# Altium schematic sheet In-Out.SchDoc
size A2
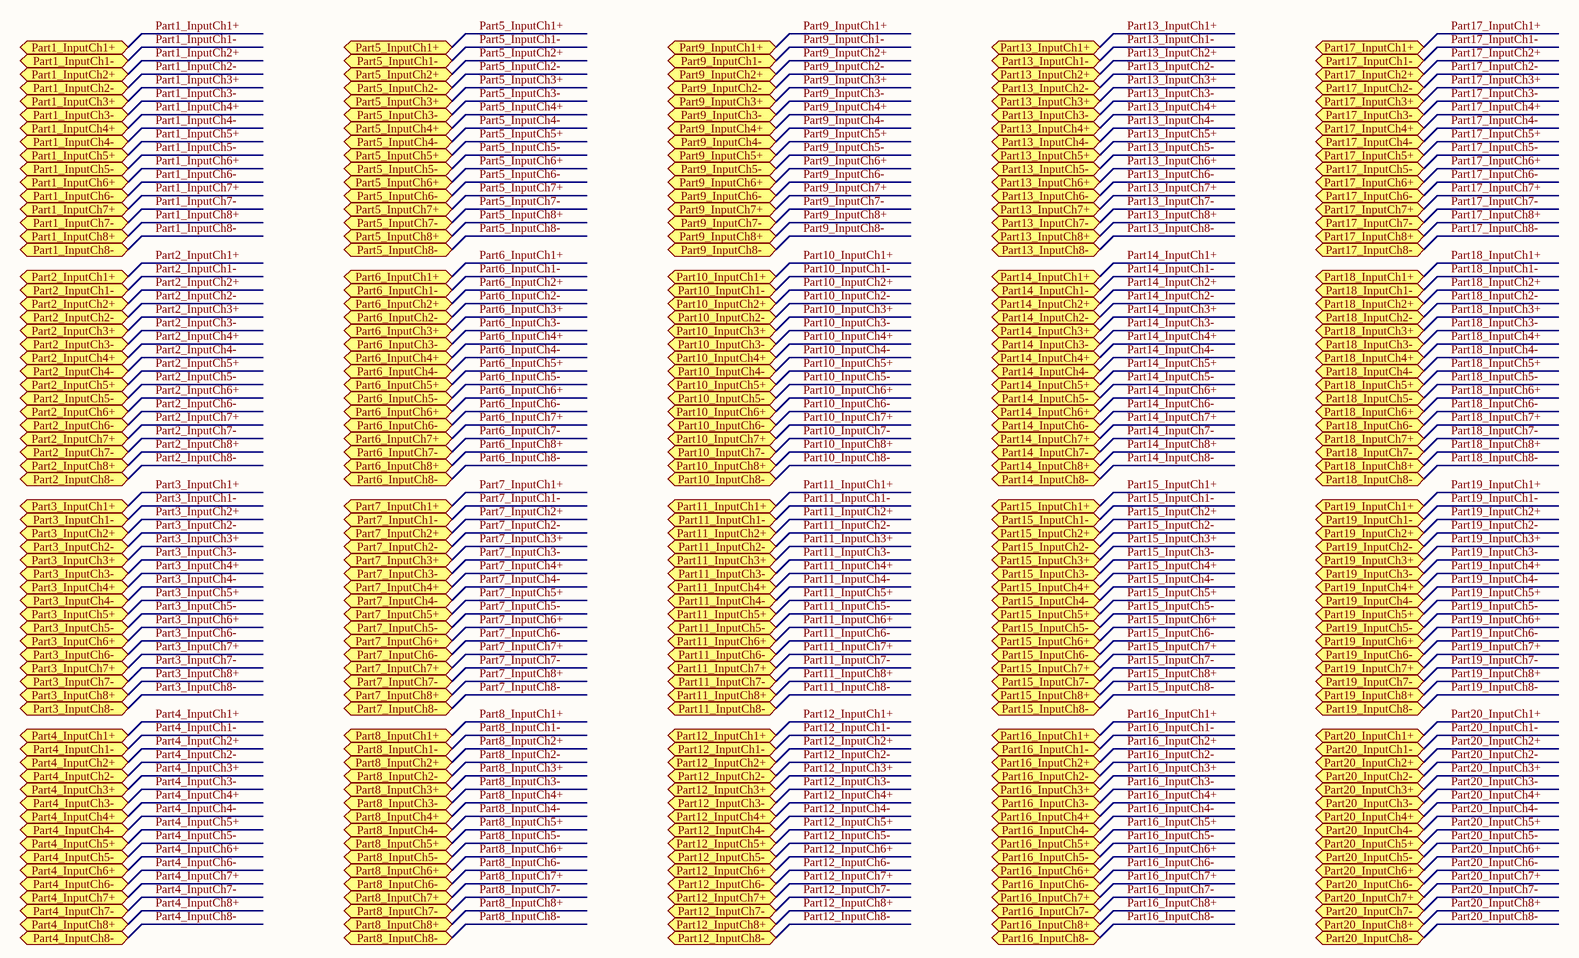
[diagram p0: In-Out.SchDoc]

## Ports
Part1_InputCh1+ (out), Part1_InputCh1- (out), Part1_InputCh2+ (out), Part1_InputCh2- (out), Part1_InputCh3+ (out), Part1_InputCh3- (out), Part1_InputCh4+ (out), Part1_InputCh4- (out), Part1_InputCh5+ (out), Part1_InputCh5- (out), Part1_InputCh6+ (out), Part1_InputCh6- (out), Part1_InputCh7+ (out), Part1_InputCh7- (out), Part1_InputCh8+ (out), Part1_InputCh8- (out), Part2_InputCh1+ (out), Part2_InputCh1- (out), Part2_InputCh2+ (out), Part2_InputCh2- (out), Part2_InputCh3+ (out), Part2_InputCh3- (out), Part2_InputCh4+ (out), Part2_InputCh4- (out), Part2_InputCh5+ (out), Part2_InputCh5- (out), Part2_InputCh6+ (out), Part2_InputCh6- (out), Part2_InputCh7+ (out), Part2_InputCh7- (out), Part2_InputCh8+ (out), Part2_InputCh8- (out), Part3_InputCh1+ (out), Part3_InputCh1- (out), Part3_InputCh2+ (out), Part3_InputCh2- (out), Part3_InputCh3+ (out), Part3_InputCh3- (out), Part3_InputCh4+ (out), Part3_InputCh4- (out), Part3_InputCh5+ (out), Part3_InputCh5- (out), Part3_InputCh6+ (out), Part3_InputCh6- (out), Part3_InputCh7+ (out), Part3_InputCh7- (out), Part3_InputCh8+ (out), Part3_InputCh8- (out), Part4_InputCh1+ (out), Part4_InputCh1- (out), Part4_InputCh2+ (out), Part4_InputCh2- (out), Part4_InputCh3+ (out), Part4_InputCh3- (out), Part4_InputCh4+ (out), Part4_InputCh4- (out), Part4_InputCh5+ (out), Part4_InputCh5- (out), Part4_InputCh6+ (out), Part4_InputCh6- (out), Part4_InputCh7+ (out), Part4_InputCh7- (out), Part4_InputCh8+ (out), Part4_InputCh8- (out), Part5_InputCh1+ (out), Part5_InputCh1- (out), Part5_InputCh2+ (out), Part5_InputCh2- (out), Part5_InputCh3+ (out), Part5_InputCh3- (out), Part5_InputCh4+ (out), Part5_InputCh4- (out), Part5_InputCh5+ (out), Part5_InputCh5- (out), Part5_InputCh6+ (out), Part5_InputCh6- (out), Part5_InputCh7+ (out), Part5_InputCh7- (out), Part5_InputCh8+ (out), Part5_InputCh8- (out), Part6_InputCh1+ (out), Part6_InputCh1- (out), Part6_InputCh2+ (out), Part6_InputCh2- (out), Part6_InputCh3+ (out), Part6_InputCh3- (out), Part6_InputCh4+ (out), Part6_InputCh4- (out), Part6_InputCh5+ (out), Part6_InputCh5- (out), Part6_InputCh6+ (out), Part6_InputCh6- (out), Part6_InputCh7+ (out), Part6_InputCh7- (out), Part6_InputCh8+ (out), Part6_InputCh8- (out), Part7_InputCh1+ (out), Part7_InputCh1- (out), Part7_InputCh2+ (out), Part7_InputCh2- (out), Part7_InputCh3+ (out), Part7_InputCh3- (out), Part7_InputCh4+ (out), Part7_InputCh4- (out), Part7_InputCh5+ (out), Part7_InputCh5- (out), Part7_InputCh6+ (out), Part7_InputCh6- (out), Part7_InputCh7+ (out), Part7_InputCh7- (out), Part7_InputCh8+ (out), Part7_InputCh8- (out), Part8_InputCh1+ (out), Part8_InputCh1- (out), Part8_InputCh2+ (out), Part8_InputCh2- (out), Part8_InputCh3+ (out), Part8_InputCh3- (out), Part8_InputCh4+ (out), Part8_InputCh4- (out), Part8_InputCh5+ (out), Part8_InputCh5- (out), Part8_InputCh6+ (out), Part8_InputCh6- (out), Part8_InputCh7+ (out), Part8_InputCh7- (out), Part8_InputCh8+ (out), Part8_InputCh8- (out), Part9_InputCh1+ (out), Part9_InputCh1- (out), Part9_InputCh2+ (out), Part9_InputCh2- (out), Part9_InputCh3+ (out), Part9_InputCh3- (out), Part9_InputCh4+ (out), Part9_InputCh4- (out), Part9_InputCh5+ (out), Part9_InputCh5- (out), Part9_InputCh6+ (out), Part9_InputCh6- (out), Part9_InputCh7+ (out), Part9_InputCh7- (out), Part9_InputCh8+ (out), Part9_InputCh8- (out), Part10_InputCh1+ (out), Part10_InputCh1- (out), Part10_InputCh2+ (out), Part10_InputCh2- (out), Part10_InputCh3+ (out), Part10_InputCh3- (out), Part10_InputCh4+ (out), Part10_InputCh4- (out), Part10_InputCh5+ (out), Part10_InputCh5- (out), Part10_InputCh6+ (out), Part10_InputCh6- (out), Part10_InputCh7+ (out), Part10_InputCh7- (out), Part10_InputCh8+ (out), Part10_InputCh8- (out), Part11_InputCh1+ (out), Part11_InputCh1- (out), Part11_InputCh2+ (out), Part11_InputCh2- (out), Part11_InputCh3+ (out), Part11_InputCh3- (out), Part11_InputCh4+ (out), Part11_InputCh4- (out), Part11_InputCh5+ (out), Part11_InputCh5- (out), Part11_InputCh6+ (out), Part11_InputCh6- (out), Part11_InputCh7+ (out), Part11_InputCh7- (out), Part11_InputCh8+ (out), Part11_InputCh8- (out), Part12_InputCh1+ (out), Part12_InputCh1- (out), Part12_InputCh2+ (out), Part12_InputCh2- (out), Part12_InputCh3+ (out), Part12_InputCh3- (out), Part12_InputCh4+ (out), Part12_InputCh4- (out), Part12_InputCh5+ (out), Part12_InputCh5- (out), Part12_InputCh6+ (out), Part12_InputCh6- (out), Part12_InputCh7+ (out), Part12_InputCh7- (out), Part12_InputCh8+ (out), Part12_InputCh8- (out), Part13_InputCh1+ (out), Part13_InputCh1- (out), Part13_InputCh2+ (out), Part13_InputCh2- (out), Part13_InputCh3+ (out), Part13_InputCh3- (out), Part13_InputCh4+ (out), Part13_InputCh4- (out), Part13_InputCh5+ (out), Part13_InputCh5- (out), Part13_InputCh6+ (out), Part13_InputCh6- (out), Part13_InputCh7+ (out), Part13_InputCh7- (out), Part13_InputCh8+ (out), Part13_InputCh8- (out), Part14_InputCh1+ (out), Part14_InputCh1- (out), Part14_InputCh2+ (out), Part14_InputCh2- (out), Part14_InputCh3+ (out), Part14_InputCh3- (out), Part14_InputCh4+ (out), Part14_InputCh4- (out), Part14_InputCh5+ (out), Part14_InputCh5- (out), Part14_InputCh6+ (out), Part14_InputCh6- (out), Part14_InputCh7+ (out), Part14_InputCh7- (out), Part14_InputCh8+ (out), Part14_InputCh8- (out), Part15_InputCh1+ (out), Part15_InputCh1- (out), Part15_InputCh2+ (out), Part15_InputCh2- (out), Part15_InputCh3+ (out), Part15_InputCh3- (out), Part15_InputCh4+ (out), Part15_InputCh4- (out), Part15_InputCh5+ (out), Part15_InputCh5- (out), Part15_InputCh6+ (out), Part15_InputCh6- (out), Part15_InputCh7+ (out), Part15_InputCh7- (out), Part15_InputCh8+ (out), Part15_InputCh8- (out), Part16_InputCh1+ (out), Part16_InputCh1- (out), Part16_InputCh2+ (out), Part16_InputCh2- (out), Part16_InputCh3+ (out), Part16_InputCh3- (out), Part16_InputCh4+ (out), Part16_InputCh4- (out), Part16_InputCh5+ (out), Part16_InputCh5- (out), Part16_InputCh6+ (out), Part16_InputCh6- (out), Part16_InputCh7+ (out), Part16_InputCh7- (out), Part16_InputCh8+ (out), Part16_InputCh8- (out), Part17_InputCh1+ (out), Part17_InputCh1- (out), Part17_InputCh2+ (out), Part17_InputCh2- (out), Part17_InputCh3+ (out), Part17_InputCh3- (out), Part17_InputCh4+ (out), Part17_InputCh4- (out), Part17_InputCh5+ (out), Part17_InputCh5- (out), Part17_InputCh6+ (out), Part17_InputCh6- (out), Part17_InputCh7+ (out), Part17_InputCh7- (out), Part17_InputCh8+ (out), Part17_InputCh8- (out), Part18_InputCh1+ (out), Part18_InputCh1- (out), Part18_InputCh2+ (out), Part18_InputCh2- (out), Part18_InputCh3+ (out), Part18_InputCh3- (out), Part18_InputCh4+ (out), Part18_InputCh4- (out), Part18_InputCh5+ (out), Part18_InputCh5- (out), Part18_InputCh6+ (out), Part18_InputCh6- (out), Part18_InputCh7+ (out), Part18_InputCh7- (out), Part18_InputCh8+ (out), Part18_InputCh8- (out), Part19_InputCh1+ (out), Part19_InputCh1- (out), Part19_InputCh2+ (out), Part19_InputCh2- (out), Part19_InputCh3+ (out), Part19_InputCh3- (out), Part19_InputCh4+ (out), Part19_InputCh4- (out), Part19_InputCh5+ (out), Part19_InputCh5- (out), Part19_InputCh6+ (out), Part19_InputCh6- (out), Part19_InputCh7+ (out), Part19_InputCh7- (out), Part19_InputCh8+ (out), Part19_InputCh8- (out), Part20_InputCh1+ (out), Part20_InputCh1- (out), Part20_InputCh2+ (out), Part20_InputCh2- (out), Part20_InputCh3+ (out), Part20_InputCh3- (out), Part20_InputCh4+ (out), Part20_InputCh4- (out), Part20_InputCh5+ (out), Part20_InputCh5- (out), Part20_InputCh6+ (out), Part20_InputCh6- (out), Part20_InputCh7+ (out), Part20_InputCh7- (out), Part20_InputCh8+ (out), Part20_InputCh8- (out)